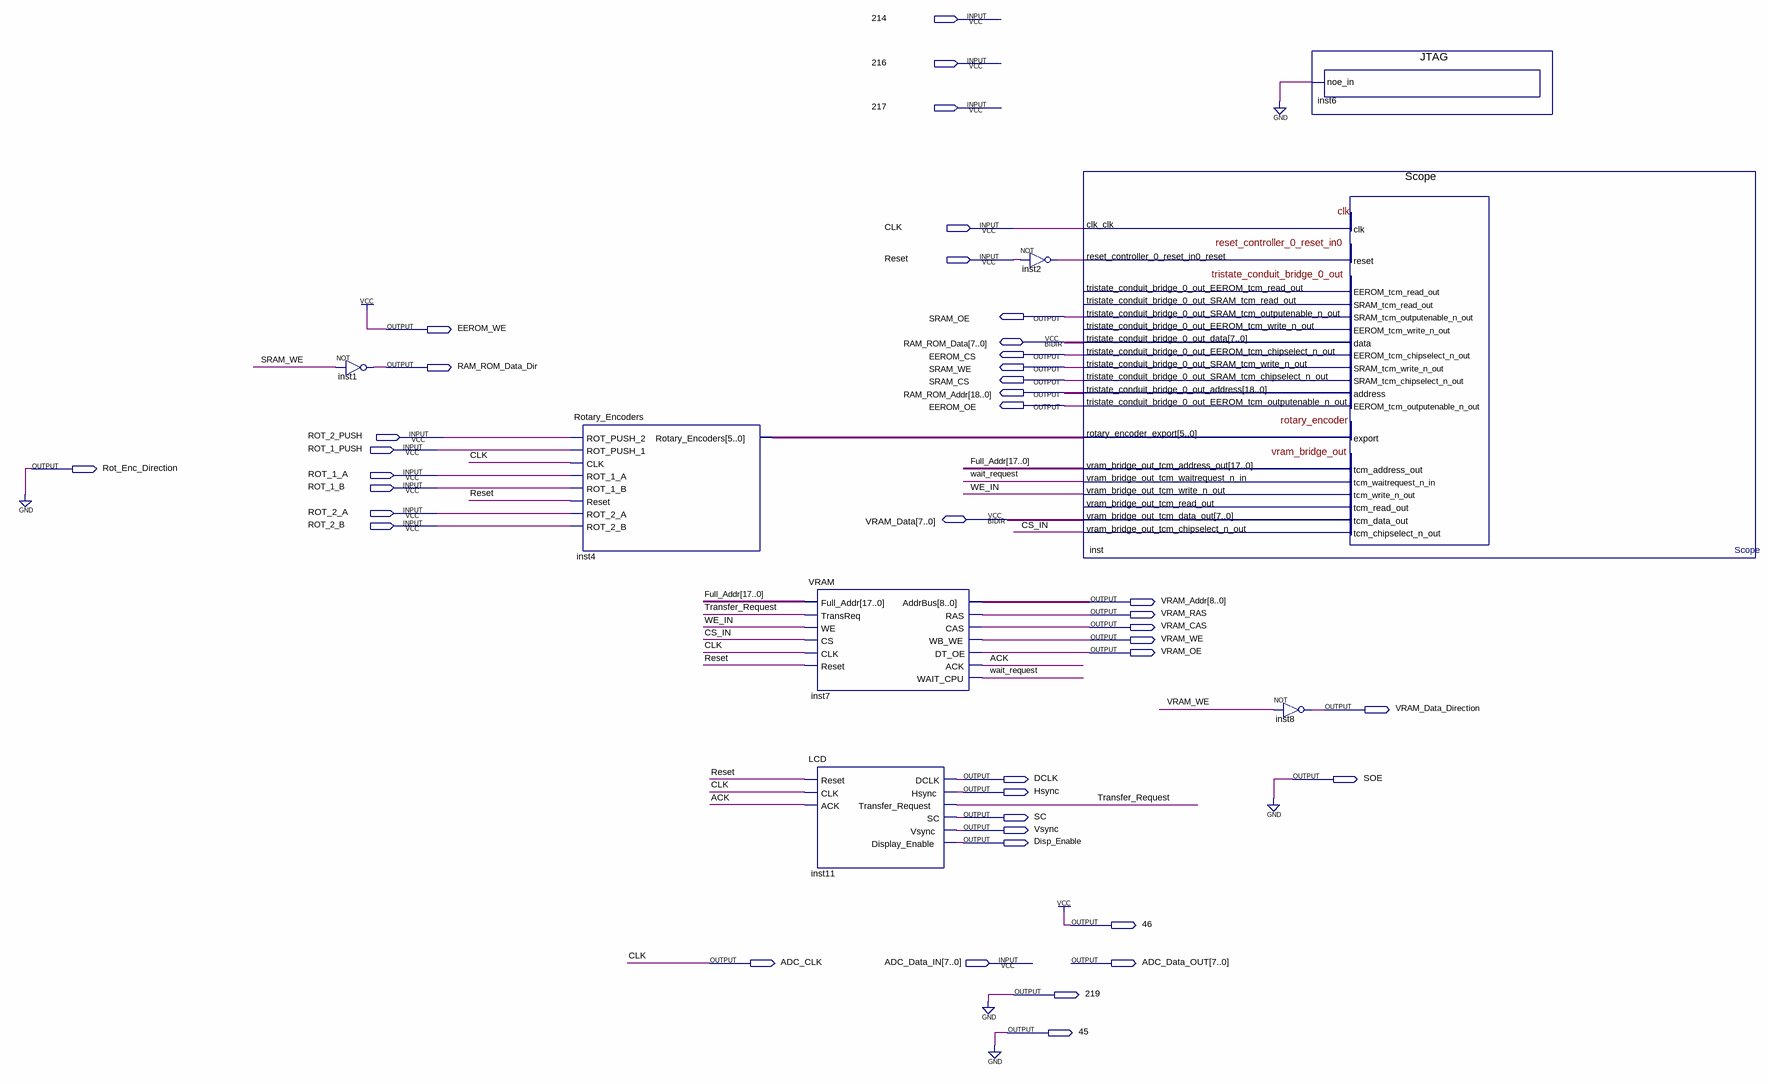
[diagram p0: schematic sheet]
// Quartus schematic Digital_Oscilloscope.bdf as structural Verilog: 8 symbols, 40 pins
module Digital_Oscilloscope (
  input  \214 ,
  input  \216 ,
  input  \217 ,
  input  CLK,
  input  Reset,
  input  ROT_2_PUSH,
  input  ROT_1_PUSH,
  input  ROT_1_A,
  input  ROT_1_B,
  input  ROT_2_A,
  input  ROT_2_B,
  input  [7:0] ADC_Data_IN,
  inout  [7:0] RAM_ROM_Data,
  inout  [7:0] VRAM_Data,
  output SRAM_OE,
  output EEROM_WE,
  output EEROM_CS,
  output RAM_ROM_Data_Dir,
  output SRAM_WE,
  output SRAM_CS,
  output [18:0] RAM_ROM_Addr,
  output EEROM_OE,
  output Rot_Enc_Direction,
  output [8:0] VRAM_Addr,
  output VRAM_RAS,
  output VRAM_CAS,
  output VRAM_WE,
  output VRAM_OE,
  output VRAM_Data_Direction,
  output DCLK,
  output SOE,
  output Hsync,
  output SC,
  output Vsync,
  output Disp_Enable,
  output \46 ,
  output ADC_CLK,
  output [7:0] ADC_Data_OUT,
  output \219 ,
  output \45 
);

  wire ACK, CS_IN, inst2_out, Transfer_Request, wait_request, WE_IN;
  wire [5:0] inst4_rotary_encoders;
  wire [17:0] Full_Addr;

  not inst1 (RAM_ROM_Data_Dir, SRAM_WE);
  Rotary_Encoders inst4 (
    .ROT_PUSH_2(ROT_2_PUSH), .ROT_PUSH_1(ROT_1_PUSH), .CLK(CLK), .ROT_1_A(ROT_1_A), .ROT_1_B(ROT_1_B),
    .Reset(Reset), .ROT_2_A(ROT_2_A), .ROT_2_B(ROT_2_B), .Rotary_Encoders(inst4_rotary_encoders));
  VRAM inst7 (
    .Full_Addr(Full_Addr), .TransReq(Transfer_Request), .WE(WE_IN), .CS(CS_IN), .CLK(CLK), .Reset(Reset),
    .AddrBus(VRAM_Addr), .RAS(VRAM_RAS), .CAS(VRAM_CAS), .WB_WE(VRAM_WE), .DT_OE(VRAM_OE), .ACK(ACK),
    .WAIT_CPU(wait_request));
  LCD inst11 (
    .Reset(Reset), .CLK(CLK), .ACK(ACK), .DCLK(DCLK), .Hsync(Hsync), .Transfer_Request(Transfer_Request),
    .SC(SC), .Vsync(Vsync), .Display_Enable(Disp_Enable));
  not inst2 (inst2_out, Reset);
  Scope inst (
    .clk_clk(CLK), .reset_controller_0_reset_in0_reset(inst2_out),
    .rotary_encoder_export(inst4_rotary_encoders), .vram_bridge_out_tcm_waitrequest_n_in(wait_request),
    .tristate_conduit_bridge_0_out_SRAM_tcm_outputenable_n_out(SRAM_OE),
    .tristate_conduit_bridge_0_out_EEROM_tcm_chipselect_n_out(EEROM_CS),
    .tristate_conduit_bridge_0_out_SRAM_tcm_write_n_out(SRAM_WE),
    .tristate_conduit_bridge_0_out_SRAM_tcm_chipselect_n_out(SRAM_CS),
    .tristate_conduit_bridge_0_out_address(RAM_ROM_Addr),
    .tristate_conduit_bridge_0_out_EEROM_tcm_outputenable_n_out(EEROM_OE),
    .vram_bridge_out_tcm_address_out(Full_Addr), .vram_bridge_out_tcm_write_n_out(WE_IN),
    .vram_bridge_out_tcm_chipselect_n_out(CS_IN), .tristate_conduit_bridge_0_out_data(RAM_ROM_Data),
    .vram_bridge_out_tcm_data_out(VRAM_Data));  // open: tristate_conduit_bridge_0_out_EEROM_tcm_read_out, tristate_conduit_bridge_0_out_SRAM_tcm_read_out, tristate_conduit_bridge_0_out_EEROM_tcm_write_n_out, vram_bridge_out_tcm_read_out
  not inst8 (VRAM_Data_Direction, VRAM_WE);
  JTAG inst6 (.noe_in(1'b0));

  assign \45  = 1'b0;
  assign \46  = 1'b1;
  assign \219  = 1'b0;
  assign ADC_CLK = CLK;
  assign EEROM_WE = 1'b1;
  assign Rot_Enc_Direction = 1'b0;
  assign SOE = 1'b0;
endmodule
